# Altium schematic sheet Power.SchDoc
size A; SheetNumber: 11; SheetTotal: 11
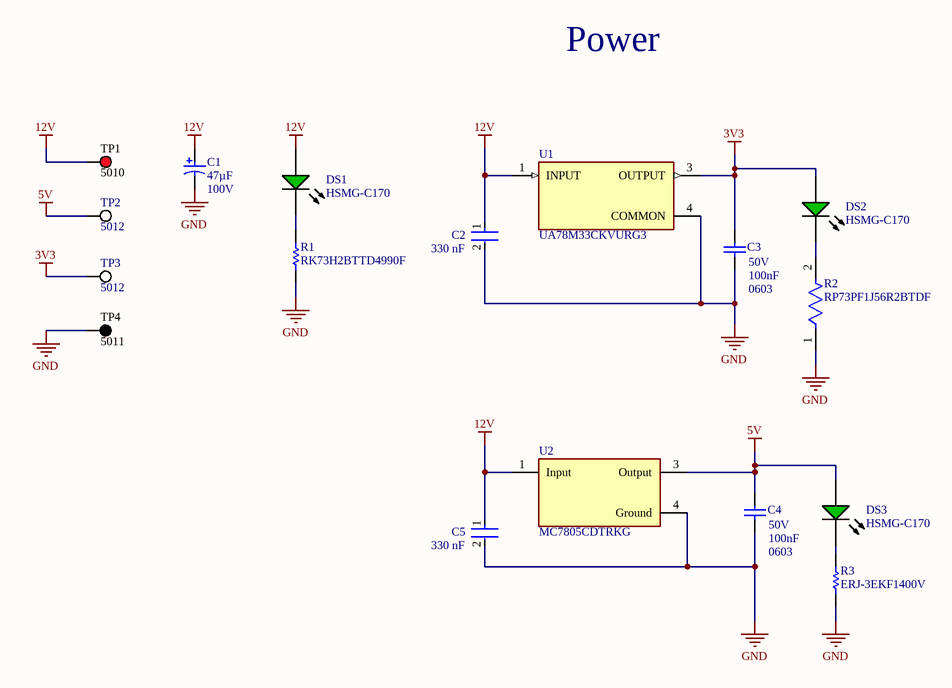
[diagram p0: Power.SchDoc]

## Parts
C1  Capacitance: 47µF  Voltage: 100V  [NIC-UUX2A470MNL1GS_L]  (hidden comment: UUX2A470MNL1GS)
C2  value 330 nF  [FP-CC0805-0_85-MFG]  (hidden comment: CC0805KKX7R7BB334)
C3  Case Code (Imperial): 0603  Capacitance: 100nF  Voltage: 50V  [CAPC1608X87X35NL15T15]  (hidden comment: C0603X104K5RACTU)
C4  Case Code (Imperial): 0603  Capacitance: 100nF  Voltage: 50V  [CAPC1608X87X35NL15T15]  (hidden comment: C0603X104K5RACTU)
C5  value 330 nF  [FP-CC0805-0_85-MFG]  (hidden comment: CC0805KKX7R7BB334)
DS1  HSMG-C170  [AVAG-HSMX-C170_V]
DS2  HSMG-C170  [AVAG-HSMX-C170_V]
DS3  HSMG-C170  [AVAG-HSMX-C170_V]
R1  RK73H2BTTD4990F  [RESC3216X70X40NL20T20]
R2  RP73PF1J56R2BTDF  [FP-RP73P-1J-MFG]
R3  ERJ-3EKF1400V  [RESC1608X55X30NL15T15]
TP1  5010  [KSTN-5010_V]
TP2  5012  [KSTN-5012_V]
TP3  5012  [KSTN-5012_V]
TP4  5011  [KSTN-5011_V]
U1  UA78M33CKVURG3  [FP-KVU0003A-MFG]
U2  MC7805CDTRKG  [FP-369C-MFG]

## Nets
3V3: C3.2 DS2.1(A) TP3.1 U1.3(OUTPUT)
5V: C4.2 DS3.1(A) TP2.1 U2.3(Output)
12V: C1.1 C2.1 C5.1 DS1.1(A) TP1.1 U1.1(INPUT) U2.1(Input)
GND: C1.2 C2.2 C3.1 C4.1 C5.2 R1.1 R2.1 R3.1 TP4.1 U1.4(COMMON) U2.4(Ground)
NetDS1_2: DS1.2(K) R1.2
NetDS2_2: DS2.2(K) R2.2
NetDS3_2: DS3.2(K) R3.2

## Notes on the sheet
- Power

## Library data of the parts
C1 = CMP-2000-07372-1: Aluminum Electrolytic Capacitor, 47 uF, +/- 20%, 100 VDC, -55 to 105 degC, 2-Pin SMD, RoHS, Tape and Reel; Manufacturer: Nichicon; Type: Can; Leakage Current: 141uA; Dissipation Factor: 0.08%; Ripple Current: 230mA; Life (Hours): 2000Hour; Lead Diameter: 1.1mm; Dielectric Material: Aluminium; Polarity: Polarized; Tan Delta: 0.08; Package Description: 2-Pin Aluminum Electrolytic Capacitor, Body 10.3 x 10.3 mm; Datasheet Version: 08/2015; Case Size/Dimension: Ø10x10mm; Mounting Technology: SurfaceMount; Operating Temp-Max: 105°C; Datasheet URL: http://products.nichicon.co.jp/en/pdf/XJA043/e-uux.pdf; Manufacturer URL: http://www.nichicon.co.jp/english/; Package Reference: UUX2A470MNL1GS; Rated Voltage: 100V; Supplier 1: Digi-Key; Supplier Part Number 1: 493-9631-1-ND; Manufacturer Part Number: UUX2A470MNL1GS; Stock 1: 24372; Pricing 1: 1 = 0.720000, 10 = 0.507000, 100 = 0.333800 (USD); RoHS: Yes; Mount: Surface Mount; Case/Package: Radial; Min Operating Temperature: -55°C; Max Operating Temperature: 105°C; Tolerance: 20%; Packaging: Tape and Reel; Voltage Rating: 100V; Voltage Rating (DC): 100V; Termination: SMD/SMT; Package Quantity: 500; Ripple Current (AC): 230mA; Features: General Purpose; Diameter: 10mm; Length: 10mm; Height: 10mm; Height - Seated (Max): 0.394inch; Lead Pitch: 4.5mm; Radiation Hardening: No; REACH SVHC: No SVHC; Supplier 2: Digikey; Supplier Part Number 2: 493-9631-6-ND; Category: Aluminum Electrolytic Capacitors; Pricing 2: 1=0.65, 10=0.455, 50=0.383, 100=0.3118 (USD); Number of Pins: 2; Package Shape: Cylindrical; Size Code: 4141; Terminal Finish: Tin; JESD-609 Code: e6; Capacitor Type: Aluminium; Negative Tolerance: 20%; Package Style: SMTMeter; Positive Tolerance: 20%; Rated DC Voltage (URdc): 100V; Width: 10.3mm; Reach SVHC Compliant: No; RoHS Compliant: Yes; ComponentLink1URL: https://datasheet.ciiva.com:443/pdfs/VipMasterIC/IC/NICH/NICH-S-A0009252175/NICH-S-A0009252175-1.pdf?src-supplier=IHS+Markit; ComponentLink1Description: https://datasheet.ciiva.com:443/pdfs/VipMasterIC/IC/NICH/NICH-S-A0009252175/NICH-S-A0009252175-1.pdf?src-supplier=IHS+Markit; ComponentLink2URL: https://datasheet.ciiva.com/30522/getdatasheetpartid-544485-30522138.pdf?src-supplier=Verical; ComponentLink2Description: https://datasheet.ciiva.com/30522/getdatasheetpartid-544485-30522138.pdf?src-supplier=Verical; ComponentLink3URL: https://datasheet.ciiva.com/11781/0900766b80fa3a40-11781984.pdf?src-supplier=Rs; ComponentLink3Description: https://datasheet.ciiva.com/11781/0900766b80fa3a40-11781984.pdf?src-supplier=Rs; ComponentLink4URL: https://datasheet.ciiva.com/5361/e-ux-11104-5361317.pdf?src-supplier=Mouser; ComponentLink4Description: https://datasheet.ciiva.com/5361/e-ux-11104-5361317.pdf?src-supplier=Mouser; ComponentLink5URL: https://datasheet.ciiva.com/7907/e-ux-7907500.pdf?src-supplier=Element14; ComponentLink5Description: https://datasheet.ciiva.com/7907/e-ux-7907500.pdf?src-supplier=Element14; ComponentLink6URL: https://datasheet.ciiva.com/28458/1913003-28458341.pdf?src-supplier=Element14; ComponentLink6Description: https://datasheet.ciiva.com/28458/1913003-28458341.pdf?src-supplier=Element14
C2 C5 = CMP-03422-000882-1: Surface Mount Ceramic Multilayer Capacitor 0.33uF 10% X7R 16V 0805 Blister T/R; Manufacturer: Yageo; Tolerance: 0.1; Height: 0.95mm; Automotive: No; Footprint Url: http://www.yageo.com/exep/pages/download/literatures/UPY-C_GEN_24.pdf; Temperature Characteristic: X7R; Device Class L3: Ceramic Capacitors; Category: Cap; Temperature Range High: +85°C; Manufacturer Part Number: CC0805KKX7R7BB334; Temperature Range Low: -30°C; ComponentLink2URL: http://www.yageo.com/documents/recent/UPY-GPHC_Y5V_6.3V-to-50V_8.pdf; Lead Free: Yes; Device Class L2: Capacitors; Package: CC0805-0.85; Material: Ceramic; Voltage Rating: 16 V; Device Class L1: Passive Components; Ipc Land Pattern Name: CAPC200125X85; Mouser Description: Multilayer Ceramic Capacitors MLCC - SMD/SMT 330nF 16V X7R 10%; Octopart: https://octopart.com/cc0805kkx7r7bb334-yageo-42334127; Capacitance: 330 nF; Temperature: -30°C to +85°C; ComponentLink2Description: Datasheet; Digikey Description: Surface Mount Ceramic Multilayer Capacitor 0.33uF 10% X7R 16V 0805 Blister T/R; RoHS: TRUE
C3 C4 = CMP-2006-03300-1: Manufacturer: Kemet; Dielectric Material: Ceramic; Tolerance: 10%; Dielectric: X7R; Dissipation Factor: 2.5%; Part Number: C0603X104K5RACTU; Supplier 1: Digi-Key; Supplier Part Number 1: 399-7969-1-ND; Manufacturer Part Number: C0603X104K5RACTU; Stock 1: 2206541; Pricing 1: 1 = 0.21000, 10 = 0.14500, 100 = 0.07340, 500 = 0.05024, 1000 = 0.04444 (USD); RoHS: Yes; Mount: Surface Mount; Case/Package: 0603; Number of Pins: 2; Case Code (Metric): 1608; Min Operating Temperature: -55°C; Max Operating Temperature: 125°C; Voltage Rating: 50V; Packaging: Tape and Reel; Package Quantity: 1; Voltage Rating (DC): 50V; Termination: SMD/SMT; Features: Soft Termination; Length: 1.6mm; Height: 0.8mm; Width: 0.8mm; Depth: 0.8mm; Thickness: 0.034inch; Radiation Hardening: No; REACH SVHC: No SVHC; ComponentLink1URL: https://datasheet.ciiva.com/7823/1776088-7823908.pdf?src-supplier=Element14; ComponentLink1Description: https://datasheet.ciiva.com/7823/1776088-7823908.pdf?src-supplier=Element14; ComponentLink2URL: https://datasheet.ciiva.com/26948/getdatasheetpartid-385607-26948458.pdf?src-supplier=Verical; ComponentLink2Description: https://datasheet.ciiva.com/26948/getdatasheetpartid-385607-26948458.pdf?src-supplier=Verical; ComponentLink3URL: https://datasheet.ciiva.com/7823/1776088-7823909.pdf?src-supplier=Element14; ComponentLink3Description: https://datasheet.ciiva.com/7823/1776088-7823909.pdf?src-supplier=Element14; ComponentLink4URL: https://datasheet.ciiva.com/6279/kem-c1013-x7r-ft-cap-smd-6279993.pdf?src-supplier=Digi-Key; ComponentLink4Description: https://datasheet.ciiva.com/6279/kem-c1013-x7r-ft-cap-smd-6279993.pdf?src-supplier=Digi-Key; ComponentLink5URL: https://datasheet.ciiva.com/28533/1918693-28533212.pdf?src-supplier=Element14; ComponentLink5Description: https://datasheet.ciiva.com/28533/1918693-28533212.pdf?src-supplier=Element14; ComponentLink6URL: https://datasheet.ciiva.com/6279/kem-c1013-x7r-ft-cap-smd-6279999.pdf?src-supplier=Digi-Key; ComponentLink6Description: https://datasheet.ciiva.com/6279/kem-c1013-x7r-ft-cap-smd-6279999.pdf?src-supplier=Digi-Key; ComponentLink7URL: https://datasheet.ciiva.com/6279/kem-c1013-x7r-ft-cap-smd-6279990.pdf?src-supplier=Digi-Key; ComponentLink7Description: https://datasheet.ciiva.com/6279/kem-c1013-x7r-ft-cap-smd-6279990.pdf?src-supplier=Digi-Key; ComponentLink8URL: https://datasheet.ciiva.com/14597/70096394-14597743.pdf?src-supplier=Allied+Electronics; ComponentLink8Description: https://datasheet.ciiva.com/14597/70096394-14597743.pdf?src-supplier=Allied+Electronics
DS1-DS3 = CMP-2000-05062-1: Chip LED, Green, 2.2 V, -40 to 85 degC, 2-Pin SMD, Pb-Free, Tape and Reel; Manufacturer: Avago; No. of Pins: 2; Peak Wavelength: 570nm; SVHC: NoSVHC(16-Jun-2014); Dominant Wavelength: 572nm; Forward Current If: 20mA; Viewing Angle: 170deg; Lens Shape: Rectangular; PIV Max: 5V; External Width: 1.25mm; LED Type: Standard; External Depth: 0.8mm; Opto Mounting Orientation: Top; Luminous Intensity: 15mcd; Luminous Intensity Min: 4mcd; Forward Voltage VF Max: 2.6V; External Length / Height: 2mm; Bulb Size: 1.25mmx1.4mm; Light Area Height: 1mm; Voltage Vf Typ: 2.2V; Operating Temperature Max: 85degC; Datasheet Version: Oct-08; MSL: MSL2A-4weeks; Peak Forward Current: 20mA; Package Description: 2-Pin Surface Mount Device, Body 2 x 1.25 mm, Height 0.8 mm; Datasheet URL: https://datasheet.ciiva.com/29280/180495-da-01-en-chip-led-hsmg-c170-gelb-gruen-29280971.pdf; Storage Temperature Min: -40degC; LED Colour: Green; Wavelength Typ: 570nm; Mounting Type: SMD; Forward Current If Max: 20mA; Dominant Wavelength Typ: 572nm; LED Mounting: SMD; Operating Temperature Range: -30degCto+85degC; Operating Temperature Min: -30degC; Manufacturer URL: http://www.avagotech.com/; Packaging: CutTape; Luminous Intensity Typ: 15mcd; Package Reference: HSMX-C170; Storage Temperature Max: 85degC; Opto Case Style: SMD; Forward Voltage: 2.2V
R1 = CMP-2003-01022-1: Manufacturer: KOA Speer; Part Number: RK73H2BTTD4990F
R2 = CMP-03211-004918-1: RES SMD 56.2 OHM 0.1% 1/6W 0603; Manufacturer: TE Connectivity; Resistance: 56.2Ω; Value: 56.2Ω; Power Rating: 0.166W; Voltage Rating: 100V; Temperature Coefficient: 25ppm/°C; Tolerance: 0.001; ComponentLink2URL: https://www.te.com/commerce/DocumentDelivery/DDEController?Action=srchrtrv&DocNm=1773272&DocType=DS&DocLang=English; RoHS: TRUE; Temperature Range Low: -55°C; Octopart: https://octopart.com/rp73pf1j56r2btdf-te+connectivity-45466141; Ipc Land Pattern Name: RESC15580X45; Automotive: No; Category: Res; Lead Free: Yes; Device Class L2: Resistors; Device Class L3: Chip SMD Resistors; Temperature: -55°C to +155°C; Digikey Description: RES SMD 56.2 OHM 0.1% 1/6W 0603; ComponentLink2Description: Datasheet; Manufacturer Part Number: RP73PF1J56R2BTDF; Device Class L1: Passive Components; Composition: Thin Film; Series: RP73P; Temperature Range High: +155°C; Height: 0.55mm; Package: RP73P-1J
R3 = CMP-2000-00245-1: Manufacturer: Panasonic; Part Number: ERJ-3EKF1400V
TP1 = CMP-1672-00002-4: Test Point, Red, Through Hole, RoHS, Bulk; Manufacturer: Keystone; Contact Material: Bronze; Mounting Technology: Through Hole; RoHSCompliant: true; Pins: 1; Package Quantity: 100; ComponentLink2Description: Datasheet; Height: 8.12 mm; ComponentLink1URL: http://www.keyelco.com/; DatasheetVersion: Rev. F, 12/2013; Mount: Through Hole; PackageReference: 5010; Contact Plating: Silver; Packaging: Bulk; Colour: Red; REACH SVHC: No SVHC; PackageDescription: 1-Pin Through Hole Device, Dia 3.17 mm; ComponentLink2URL: http://www.keyelco.com/product-pdf.cfm?p=1319; ComponentLink1Description: Manufacturer URL
TP2 TP3 = CMP-1672-00004-4: Test Point, White, Through Hole, RoHS, Bulk; Manufacturer: Keystone; DatasheetVersion: Rev. F, 12/2013; ComponentLink1URL: http://www.keyelco.com/; PackageReference: 5012; RoHSCompliant: true; ComponentLink2Description: Datasheet; Colour: White; Contact Material: Bronze; PackageDescription: 1-Pin Through Hole Device, Dia 3.17 mm; Mounting Technology: Through Hole; Mount: Through Hole; Package Quantity: 100; ComponentLink1Description: Manufacturer URL; Pins: 1; Height: 8.12 mm; Packaging: Bulk; REACH SVHC: No SVHC; Contact Plating: Silver; Length: 11.3 mm; ComponentLink2URL: http://www.keyelco.com/product-pdf.cfm?p=1321
TP4 = CMP-1672-00003-4: Test Point, Black, Through Hole, RoHS, Bulk; Manufacturer: Keystone; ComponentLink2URL: http://www.keyelco.com/product-pdf.cfm?p=1320; Colour: Black; Pins: 1; REACH SVHC: No SVHC; ComponentLink1URL: http://www.keyelco.com/; PackageReference: 5011; Contact Plating: Silver; Package Quantity: 100; Packaging: Bulk; RoHSCompliant: true; Height: 8.12 mm; PackageDescription: 1-Pin Through Hole Device, Dia 3.17 mm; Mount: Through Hole; Mounting Technology: Through Hole; DatasheetVersion: Rev. F, 12/2013; ComponentLink1Description: Manufacturer URL; Contact Material: Bronze; ComponentLink2Description: Datasheet
U1 = CMP-04917-000046-1: IC REG LINEAR 3.3V 500MA TO252-3; Manufacturer: Texas Instruments; Nominal Supply Current: 4.5mA; Output Type: Fixed; Dropout Voltage: 2V; Number Of Outputs: 1; Max Supply Voltage: 25V; Standoff Height: 0mm; Max Junction Temp: +125°C; Accuracy Percentage: 3%; Min Supply Voltage: 5.3V; Temperature: 0°C to +125°C; Automotive: No; Package: KVU0003A; Category: IC; Output Current: 500mA; RoHS: TRUE; ComponentLink2Description: Datasheet; ComponentLink2URL: http://www.ti.com/lit/ds/symlink/ua78m.pdf; Height: 2.65mm; Output Voltage: 3.3V; Octopart: https://octopart.com/ua78m33ckvurg3-texas+instruments-669262; Mouser Description: Linear Voltage Regulators 3.3 V 500mA Fix Pos Voltage Regulator; Device Class L3: Voltage Regulators - Linear; Lead Free: Yes; Device Class L2: Power Management ICs; Device Class L1: Integrated Circuits (ICs); Digikey Description: IC REG LINEAR 3.3V 500MA TO252-3; Temperature Range Low: 0°C; Manufacturer Part Number: UA78M33CKVURG3; Temperature Range High: +125°C
U2 = CMP-07128-000033-1: IC REG LINEAR 5V 1A DPAK; Max Output Voltage: 5.2V; Dropout Voltage: 2V; Accuracy: 4%; Number of Regulators: 1; Min Input Voltage: 10V; Max Input Voltage: 35V; Output Type: Fixed; Power Supply Rejection Ratio (PSRR): 83dB; Polarity: Positive; Quiescent Current: 3.2mA; Mount: Surface Mount; Number of Pins: 3; Nominal Output Voltage: 5V; Lead Free: Lead Free; Contact Plating: Tin; Packaging: Tape and Reel; Max Output Current: 1A; Width: 6.22mm; Min Operating Temperature: 0°C; Min Output Voltage: 5V; Max Operating Temperature: 125°C; Halogen Free: Halogen Free; Output Current: 1A; Output Voltage: 5V; Case/Package: DPAK; Radiation Hardening: No; Number of Outputs: 1; Height: 2.38mm; Package Quantity: 1; REACH SVHC: No SVHC; Output Voltage Accuracy: 4%; Length: 6.73mm